# EasyEDA Pro project ProProject_aDataFlow_v2_pub_2024-01-13.epro, schematic Schematic1
Create Date: 2023-12-28; Page Name: P1; Project Name: aDataFlow_v2_pub; Schematic Name: Schematic1; Update Date: 2023-12-28; Company: 嘉立创EDA
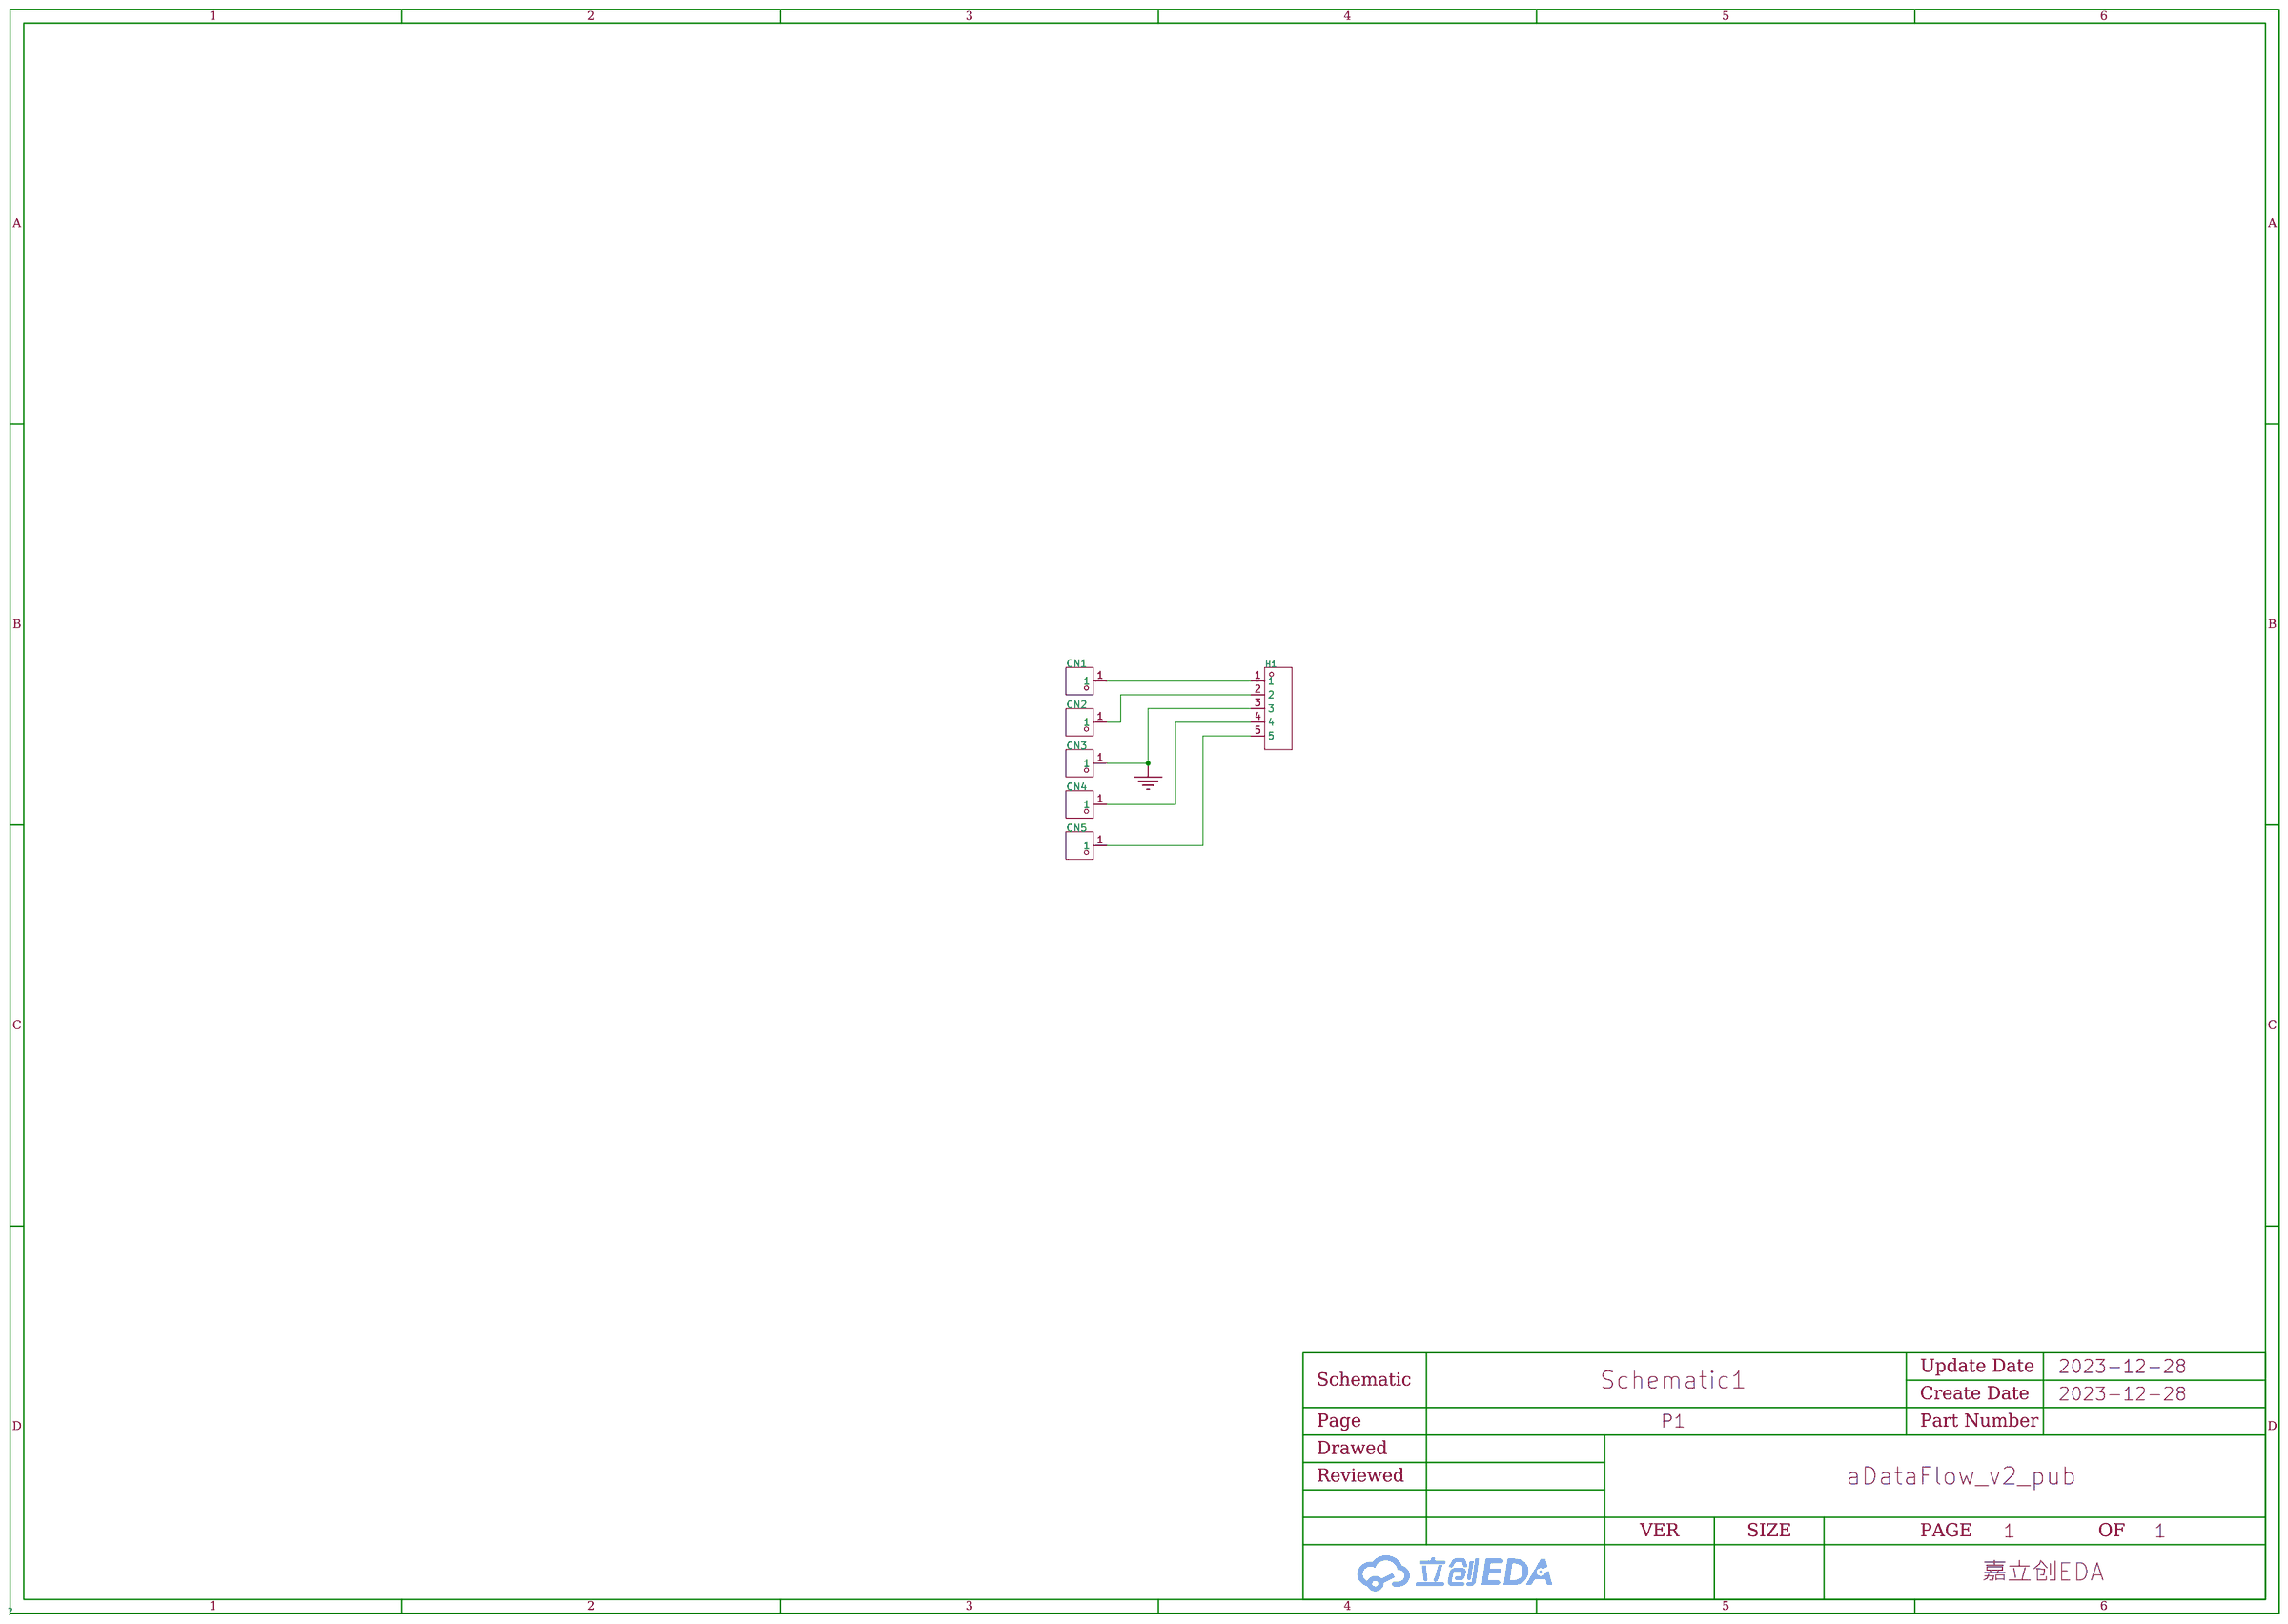
[diagram p2: schematic sheet]

## Parts
CN1  YTC1P-2510-01  [SMD-1_BD2.0-H10.0]
CN2  YTC1P-2510-01  [SMD-1_BD2.0-H10.0]
CN3  YTC1P-2510-01  [SMD-1_BD2.0-H10.0]
CN4  YTC1P-2510-01  [SMD-1_BD2.0-H10.0]
CN5  YTC1P-2510-01  [SMD-1_BD2.0-H10.0]
H1  PZ254R-11-05P  [HDR-TH_5P-P2.54-H-M-W10.4]

## Library data of the parts
CN1-CN5 = YTC1P-2510-01: 类型:弹簧顶针(POGO PIN);PIN位数:单PIN位;全长/全高:3.5mm;额定电流:2.5A;额定电压:12V;触头材质:黄铜;触头镀层:金;; LCSC Part Name: POGO PIN弹簧顶针 贴片连接器; Supplier Part: C5221288; Manufacturer: YIYUAN(怡远); JLCPCB Part Class: 扩展库; Datasheet: https://atta.szlcsc.com/upload/public/pdf/source/20221031/BD070516233C1C93A35D01CFB419D0D5.pdf; Supplier: LCSC; Type: 弹簧顶针(POGO PIN); Number of Pins: 单PIN位; Overall Length/Height: 3.5mm; Rated Current: 2.5A; Rated Voltage: 12V; Contact Material: 黄铜; Contact Plating: 金
H1 = PZ254R-11-05P: 间距:2.54mm;总PIN位数:5;排数:1;插针结构:1x5P;行距:-;安装类型:弯插;圆针/方针:方针;额定电流:-;额定电压:-;配合针长度:6mm;塑高:2.5mm;触头材质:黄铜;触头镀层:-;工作温度范围:-40℃~+105℃;颜色:黑色;; LCSC Part Name: 2.54mm 1x5P 弯插 方针; Supplier Part: C492413; Manufacturer: XFCN(兴飞); Supplier Footprint: 插件,P=2.54mm; JLCPCB Part Class: 扩展库; Supplier: LCSC; Pitch: 2.54mm; Number of Pins: 5; Number of Rows: 1; Pin Structure: 1x5P; Mounting Type: 弯插; Circluar Pins/Square Pins: 方针; Length of Mating Pin: 6mm; Insulation Height: 2.5mm; Contact Material: 黄铜; Operating Temperature Range: -40℃~+105℃; Color: 黑色

## Nets
GND: CN3.1 H1.3
$1N347: CN1.1 H1.1
$1N350: CN2.1 H1.2
$1N360: CN4.1 H1.4
$1N365: CN5.1 H1.5
